# Altium schematic sheet CPU_Logic.SchDoc: Title
size A3; Date: Date; CompanyName: Integrated Micro-Electronics Bulgaria; Organization: Design & Development Department; Address1: Drawing Type; Address2: Address 1; Address3: Address 2; Address4: Address 3; DocumentNumber: 730xxx; Revision: 01; SheetNumber: 1; SheetTotal: 1; PageSetup: Record=PageOptions|CenterHorizontal=True|CenterVertical=True|PrintScale=0.70|XCorrection=1.00|YCorrection=1.00|PrintKind=2|BorderSize=5000000|LeftOffset=0|BottomOffset=0|Orientation=2|PaperLength=1000|PaperWidth=1000|Scale=100|PaperSource=7|PrintQuality=-4|MediaType=1|DitherType=10|PaperKind=A4|PrintScaleMode=1; SheetSize: A3; Time: Time; ModifiedDate: Mod. Date
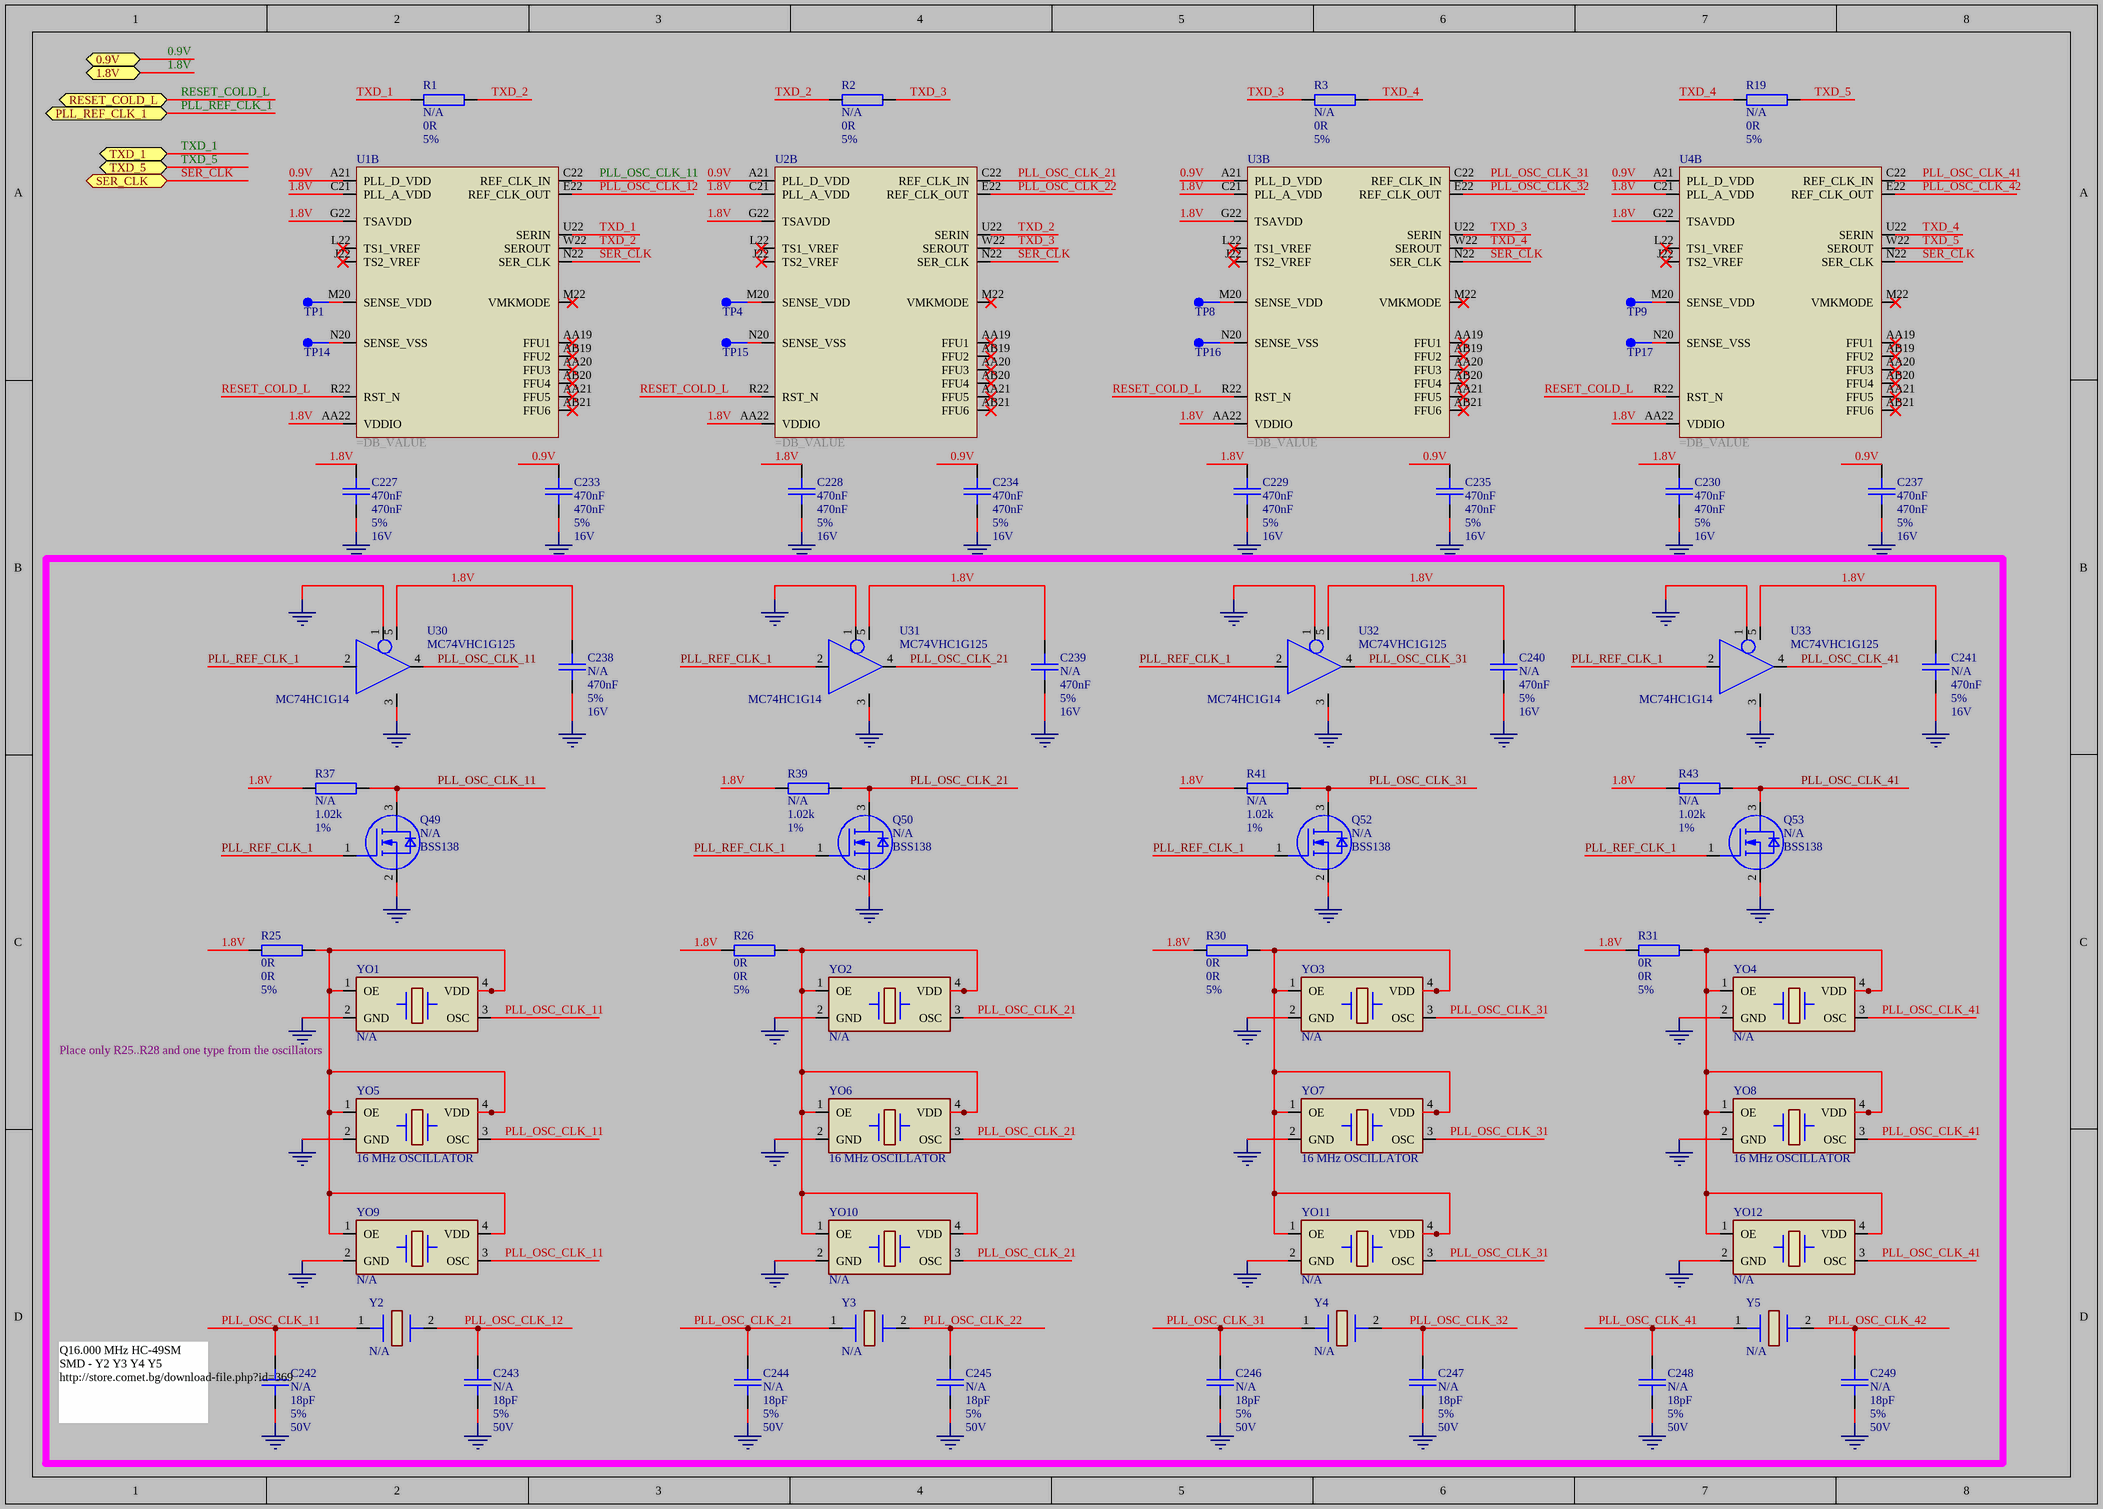
[diagram p0: CPU_Logic.SchDoc]

## Parts
C227  470nF  DB_TOLERANCE: 5%  DB_VOLTAGE: 16V  [SMD_0603_CAPC1608X95N]
C228  470nF  DB_TOLERANCE: 5%  DB_VOLTAGE: 16V  [SMD_0603_CAPC1608X95N]
C229  470nF  DB_TOLERANCE: 5%  DB_VOLTAGE: 16V  [SMD_0603_CAPC1608X95N]
C230  470nF  DB_TOLERANCE: 5%  DB_VOLTAGE: 16V  [SMD_0603_CAPC1608X95N]
C233  470nF  DB_TOLERANCE: 5%  DB_VOLTAGE: 16V  [SMD_0603_CAPC1608X95N]
C234  470nF  DB_TOLERANCE: 5%  DB_VOLTAGE: 16V  [SMD_0603_CAPC1608X95N]
C235  470nF  DB_TOLERANCE: 5%  DB_VOLTAGE: 16V  [SMD_0603_CAPC1608X95N]
C237  470nF  DB_TOLERANCE: 5%  DB_VOLTAGE: 16V  [SMD_0603_CAPC1608X95N]
C238  N/A  DB_VALUE: 470nF  DB_TOLERANCE: 5%  DB_VOLTAGE: 16V  [SMD_0603_CAPC1608X95N]
C239  N/A  DB_VALUE: 470nF  DB_TOLERANCE: 5%  DB_VOLTAGE: 16V  [SMD_0603_CAPC1608X95N]
C240  N/A  DB_VALUE: 470nF  DB_TOLERANCE: 5%  DB_VOLTAGE: 16V  [SMD_0603_CAPC1608X95N]
C241  N/A  DB_VALUE: 470nF  DB_TOLERANCE: 5%  DB_VOLTAGE: 16V  [SMD_0603_CAPC1608X95N]
C242  N/A  DB_VALUE: 18pF  DB_TOLERANCE: 5%  DB_VOLTAGE: 50V  [SMD_0603_CAPC1608X95N]
C243  N/A  DB_VALUE: 18pF  DB_TOLERANCE: 5%  DB_VOLTAGE: 50V  [SMD_0603_CAPC1608X95N]
C244  N/A  DB_VALUE: 18pF  DB_TOLERANCE: 5%  DB_VOLTAGE: 50V  [SMD_0603_CAPC1608X95N]
C245  N/A  DB_VALUE: 18pF  DB_TOLERANCE: 5%  DB_VOLTAGE: 50V  [SMD_0603_CAPC1608X95N]
C246  N/A  DB_VALUE: 18pF  DB_TOLERANCE: 5%  DB_VOLTAGE: 50V  [SMD_0603_CAPC1608X95N]
C247  N/A  DB_VALUE: 18pF  DB_TOLERANCE: 5%  DB_VOLTAGE: 50V  [SMD_0603_CAPC1608X95N]
C248  N/A  DB_VALUE: 18pF  DB_TOLERANCE: 5%  DB_VOLTAGE: 50V  [SMD_0603_CAPC1608X95N]
C249  N/A  DB_VALUE: 18pF  DB_TOLERANCE: 5%  DB_VOLTAGE: 50V  [SMD_0603_CAPC1608X95N]
Q49  N/A  DB_VALUE: BSS138  [SMD_SOT23_SOT95P240X112-3N]
Q50  N/A  DB_VALUE: BSS138  [SMD_SOT23_SOT95P240X112-3N]
Q52  N/A  DB_VALUE: BSS138  [SMD_SOT23_SOT95P240X112-3N]
Q53  N/A  DB_VALUE: BSS138  [SMD_SOT23_SOT95P240X112-3N]
R1  N/A  DB_VALUE: 0R  DB_TOLERANCE: 5%  [SMD_0201_RESC0603X26N]
R2  N/A  DB_VALUE: 0R  DB_TOLERANCE: 5%  [SMD_0201_RESC0603X26N]
R3  N/A  DB_VALUE: 0R  DB_TOLERANCE: 5%  [SMD_0201_RESC0603X26N]
R19  N/A  DB_VALUE: 0R  DB_TOLERANCE: 5%  [SMD_0201_RESC0603X26N]
R25  0R  DB_TOLERANCE: 5%  [SMD_0603_RESC1608X55N]
R26  0R  DB_TOLERANCE: 5%  [SMD_0603_RESC1608X55N]
R30  0R  DB_TOLERANCE: 5%  [SMD_0603_RESC1608X55N]
R31  0R  DB_TOLERANCE: 5%  [SMD_0603_RESC1608X55N]
R37  N/A  DB_VALUE: 1.02k  DB_TOLERANCE: 1%  [SMD_0603_RESC1608X55N]
R39  N/A  DB_VALUE: 1.02k  DB_TOLERANCE: 1%  [SMD_0603_RESC1608X55N]
R41  N/A  DB_VALUE: 1.02k  DB_TOLERANCE: 1%  [SMD_0603_RESC1608X55N]
R43  N/A  DB_VALUE: 1.02k  DB_TOLERANCE: 1%  [SMD_0603_RESC1608X55N]
TP1  100_254  [SMD_TP_100-254]  (value not drawn)
TP4  100_254  [SMD_TP_100-254]  (value not drawn)
TP8  100_254  [SMD_TP_100-254]  (value not drawn)
TP9  100_254  [SMD_TP_100-254]  (value not drawn)
TP14  100_254  [SMD_TP_100-254]  (value not drawn)
TP15  100_254  [SMD_TP_100-254]  (value not drawn)
TP16  100_254  [SMD_TP_100-254]  (value not drawn)
TP17  100_254  [SMD_TP_100-254]  (value not drawn)
U1  (no value)  [SMD_BGA480C80P22X22]  (part B of 2)
U2  (no value)  [SMD_BGA480C80P22X22]  (part B of 2)
U3  (no value)  [SMD_BGA480C80P22X22]  (part B of 2)
U4  (no value)  [SMD_BGA480C80P22X22]  (part B of 2)
U30  DB_VALUE: MC74VHC1G125  [SMD_SOT95P280X110-5N]  (hidden comment: N/A)
U31  DB_VALUE: MC74VHC1G125  [SMD_SOT95P280X110-5N]  (hidden comment: N/A)
U32  DB_VALUE: MC74VHC1G125  [SMD_SOT95P280X110-5N]  (hidden comment: N/A)
U33  DB_VALUE: MC74VHC1G125  [SMD_SOT95P280X110-5N]  (hidden comment: N/A)
Y2  N/A  [SMD_HC49_XTAL1140X480X420N]
Y3  N/A  [SMD_HC49_XTAL1140X480X420N]
Y4  N/A  [SMD_HC49_XTAL1140X480X420N]
Y5  N/A  [SMD_HC49_XTAL1140X480X420N]
YO1  N/A  [SMD_OSCCF320X400X90-4N]
YO2  N/A  [SMD_OSCCF320X400X90-4N]
YO3  N/A  [SMD_OSCCF320X400X90-4N]
YO4  N/A  [SMD_OSCCF320X400X90-4N]
YO5  16 MHz OSCILLATOR  [SMD_OSCCF250X320X90-4N]
YO6  16 MHz OSCILLATOR  [SMD_OSCCF250X320X90-4N]
YO7  16 MHz OSCILLATOR  [SMD_OSCCF250X320X90-4N]
YO8  16 MHz OSCILLATOR  [SMD_OSCCF250X320X90-4N]
YO9  N/A  [SMD_OSCCF200X250X90-4N]
YO10  N/A  [SMD_OSCCF200X250X90-4N]
YO11  N/A  [SMD_OSCCF200X250X90-4N]
YO12  N/A  [SMD_OSCCF200X250X90-4N]

## Ports
0.9V, 1.8V, PLL_REF_CLK_1, RESET_COLD_L, SER_CLK, TXD_1, TXD_5

## Nets
GND: C227.1 C228.1 C229.1 C230.1 C233.1 C234.1 C235.1 C237.1 C238.1 C239.1 C240.1 C241.1 C242.2 C243.2 C244.2 C245.2 C246.2 C247.2 C248.2 C249.2 Q49.2(S) Q50.2(S) Q52.2(S) Q53.2(S) U30.1(~{OE}) U30.3(GND) U31.1(~{OE}) U31.3(GND) U32.1(~{OE}) U32.3(GND) U33.1(~{OE}) U33.3(GND) YO1.2(GND) YO2.2(GND) YO3.2(GND) YO4.2(GND) YO5.2(GND) YO6.2(GND) YO7.2(GND) YO8.2(GND) YO9.2(GND) YO10.2(GND) YO11.2(GND) YO12.2(GND)
0.9V: C233.2 C234.2 C235.2 C237.2 U1.A21(PLL_D_VDD) U2.A21(PLL_D_VDD) U3.A21(PLL_D_VDD) U4.A21(PLL_D_VDD) ; port 0.9V
1.8V: C227.2 C228.2 C229.2 C230.2 C238.2 C239.2 C240.2 C241.2 R25.1 R26.1 R30.1 R31.1 R37.1 R39.1 R41.1 R43.1 U1.AA22(VDDIO) U1.C21(PLL_A_VDD) U1.G22(TSAVDD) U2.AA22(VDDIO) U2.C21(PLL_A_VDD) U2.G22(TSAVDD) U3.AA22(VDDIO) U3.C21(PLL_A_VDD) U3.G22(TSAVDD) U4.AA22(VDDIO) U4.C21(PLL_A_VDD) U4.G22(TSAVDD) U30.5(VCC) U31.5(VCC) U32.5(VCC) U33.5(VCC) ; port 1.8V
PLL_OSC_CLK_11: C242.1 Q49.3(D) R37.2 U1.C22(REF_CLK_IN) U30.4(OUTY) Y2.1 YO1.3(OSC) YO5.3(OSC) YO9.3(OSC)
PLL_OSC_CLK_12: C243.1 U1.E22(REF_CLK_OUT) Y2.2
PLL_OSC_CLK_21: C244.1 Q50.3(D) R39.2 U2.C22(REF_CLK_IN) U31.4(OUTY) Y3.1 YO2.3(OSC) YO6.3(OSC) YO10.3(OSC)
PLL_OSC_CLK_22: C245.1 U2.E22(REF_CLK_OUT) Y3.2
PLL_OSC_CLK_31: C246.1 Q52.3(D) R41.2 U3.C22(REF_CLK_IN) U32.4(OUTY) Y4.1 YO3.3(OSC) YO7.3(OSC) YO11.3(OSC)
PLL_OSC_CLK_32: C247.1 U3.E22(REF_CLK_OUT) Y4.2
PLL_OSC_CLK_41: C248.1 Q53.3(D) R43.2 U4.C22(REF_CLK_IN) U33.4(OUTY) Y5.1 YO4.3(OSC) YO8.3(OSC) YO12.3(OSC)
PLL_OSC_CLK_42: C249.1 U4.E22(REF_CLK_OUT) Y5.2
PLL_REF_CLK_1: Q49.1(G) Q50.1(G) Q52.1(G) Q53.1(G) U30.2(INA) U31.2(INA) U32.2(INA) U33.2(INA) ; port PLL_REF_CLK_1
RESET_COLD_L: U1.R22(RST_N) U2.R22(RST_N) U3.R22(RST_N) U4.R22(RST_N) ; port RESET_COLD_L
SER_CLK: U1.N22(SER_CLK) U2.N22(SER_CLK) U3.N22(SER_CLK) U4.N22(SER_CLK) ; port SER_CLK
TXD_1: R1.1 U1.U22(SERIN) ; port TXD_1
TXD_2: R1.2 R2.1 U1.W22(SEROUT) U2.U22(SERIN)
TXD_3: R2.2 R3.1 U2.W22(SEROUT) U3.U22(SERIN)
TXD_4: R3.2 R19.1 U3.W22(SEROUT) U4.U22(SERIN)
TXD_5: R19.2 U4.W22(SEROUT) ; port TXD_5
NetR25_2: R25.2 YO1.1(OE) YO1.4(VDD) YO5.1(OE) YO5.4(VDD) YO9.1(OE) YO9.4(VDD)
NetR26_2: R26.2 YO2.1(OE) YO2.4(VDD) YO6.1(OE) YO6.4(VDD) YO10.1(OE) YO10.4(VDD)
NetR30_2: R30.2 YO3.1(OE) YO3.4(VDD) YO7.1(OE) YO7.4(VDD) YO11.1(OE) YO11.4(VDD)
NetR31_2: R31.2 YO4.1(OE) YO4.4(VDD) YO8.1(OE) YO8.4(VDD) YO12.1(OE) YO12.4(VDD)
NetTP1_1: TP1.1 U1.M20(SENSE_VDD)
NetTP4_1: TP4.1 U2.M20(SENSE_VDD)
NetTP8_1: TP8.1 U3.M20(SENSE_VDD)
NetTP9_1: TP9.1 U4.M20(SENSE_VDD)
NetTP14_1: TP14.1 U1.N20(SENSE_VSS)
NetTP15_1: TP15.1 U2.N20(SENSE_VSS)
NetTP16_1: TP16.1 U3.N20(SENSE_VSS)
NetTP17_1: TP17.1 U4.N20(SENSE_VSS)

Not connected (* = marked no-connect by the designer): U1 AA19(FFU1)* AA20(FFU3)* AA21(FFU5)* AB19(FFU2)* AB20(FFU4)* AB21(FFU6)* J22(TS2_VREF)* L22(TS1_VREF)* M22(VMKMODE)*; U2 AA19(FFU1)* AA20(FFU3)* AA21(FFU5)* AB19(FFU2)* AB20(FFU4)* AB21(FFU6)* J22(TS2_VREF)* L22(TS1_VREF)* M22(VMKMODE)*; U3 AA19(FFU1)* AA20(FFU3)* AA21(FFU5)* AB19(FFU2)* AB20(FFU4)* AB21(FFU6)* J22(TS2_VREF)* L22(TS1_VREF)* M22(VMKMODE)*; U4 AA19(FFU1)* AA20(FFU3)* AA21(FFU5)* AB19(FFU2)* AB20(FFU4)* AB21(FFU6)* J22(TS2_VREF)* L22(TS1_VREF)* M22(VMKMODE)*

## Notes on the sheet
- (near U30) MC74HC1G14
- (near U31) MC74HC1G14
- (near U32) MC74HC1G14
- (near U33) MC74HC1G14
- (near YO1) Place only R25..R28 and one type from the oscillators
- Q16.000 MHz HC-49SM SMD - Y2 Y3 Y4 Y5
  http://store.comet.bg/download-file.php?id=369

## Library data of the parts
C227-C230 C233-C235 C237-C241 = CAP000028169: DB_PART_TYPE: Ceramic_SMD\Standard_X7R; DB_MANUFACTURER_PART: KEMET    C0603C474J4RAC; NOTE: <NOTE>; DB_T_RANGE: -55 to 125; DB_PACKAGE: 0603; DB_DESCRIPTION: C X7R 470nF 5% 16V 0603; DB_STATUS: NEW; DB_PART_NUMBER: CAP000028169; DB_PCB_DEVICE: SMD_0603_CAPC1608X95N; DB_APPROVED_ON: 09.10.2010; DB_DATASHEET: http://john.epiqdesign.com/projects/CIS_Datasheets/F3102_CE_Kemet.pdf?rev=92&sc=0
  C227-C230 C233-C235 C237: DB_VALUE: 470nF
C242-C249 = CAP000031922: DB_PART_TYPE: Ceramic_SMD\Standard_C0G; DB_MANUFACTURER_PART: KEMET    C0603C180J5GAC; NOTE: <NOTE>; DB_T_RANGE: -55 to 125; DB_PACKAGE: 0603; DB_DESCRIPTION: C C0G 18pF 5% 50V 0603; DB_STATUS: NEW; DB_PART_NUMBER: CAP000031922; DB_PCB_DEVICE: SMD_0603_CAPC1608X95N; DB_APPROVED_ON: 09.10.2010; DB_DATASHEET: http://john.epiqdesign.com/projects/CIS_Datasheets/F3102_CE_Kemet.pdf?rev=92&sc=0
Q49 Q50 Q52 Q53 = TRA000001460: DB_PART_TYPE: MOSFET\N_Channel; DB_MANUFACTURER_PART: FAIRCHILD        BSS138LT1G; NOTE: <NOTE>; DB_T_RANGE: -55 to 150; DB_VOLTAGE: 50V; DB_CURRENT: 0.22A; DB_PACKAGE: SOT-23-3; DB_DESCRIPTION: TRANS BSS138 SOT-23-3; DB_APPROVED_BY: VSN; DB_STATUS: NEW; DB_PART_NUMBER: TRA000001460; DB_PCB_DEVICE: SMD_SOT23_SOT95P240X112-3N; DB_APPROVED_ON: 14.01.2011 10:29:14; DB_DATASHEET: http://john.epiqdesign.com/projects/CIS_Datasheets/BSS138LT1-D_Fairchild.pdf?rev=55&sc=0
R1-R3 R19 = RES000005659: DB_PART_TYPE: SMD; DB_MANUFACTURER_PART: YAGEO    RC0201JR-070R; NOTE: <NOTE>; R_BDS: R; DB_T_RANGE: -55 to 125; DB_POWER: 1/20W; DB_PACKAGE: 0201; DB_DESCRIPTION: R SMD 0R 5% 1/20W 0201; DB_PRICE: 0.00269; DB_STATUS: NEW; DB_PART_NUMBER: RES000005659; DB_PCB_DEVICE: SMD_0201_RESC0603X26N; DB_PRICE_DATE: 07-02-2013; DB_APPROVED_ON: 09.10.2010; DB_DATASHEET: http://john.epiqdesign.com/projects/CIS_Datasheets/PYu-RC0201_51_RoHS_L_7_YAGEO.pdf?rev=138&sc=0
R25 R26 R30 R31 = RES000006349: DB_PART_TYPE: SMD; DB_MANUFACTURER_PART: YAGEO    RC0603JR-070R; NOTE: <NOTE>; R_BDS: R; DB_T_RANGE: -55 to 155; DB_POWER: 1/10W; DB_PACKAGE: 0603; DB_DESCRIPTION: R SMD 0R 5% 1/10W 0603; DB_PRICE: 0.000364; DB_MOQ: 5000; DB_STATUS: NEW; DB_PART_NUMBER: RES000006349; DB_VALUE: 0R; DB_PCB_DEVICE: SMD_0603_RESC1608X55N; DB_PRICE_DATE: 2010-12-23; DB_APPROVED_ON: 09.10.2010; DB_DATASHEET: http://john.epiqdesign.com/projects/CIS_Datasheets/PYu-RC0603_51_RoHS_L_4_YAGEO.pdf?rev=138&sc=0
R37 R39 R41 R43 = RES000001446: DB_PART_TYPE: SMD; DB_MANUFACTURER_PART: YAGEO    RC0603FR-071K02; NOTE: <NOTE>; R_BDS: R; DB_T_RANGE: -55 to 155; DB_POWER: 1/10W; DB_PACKAGE: 0603; DB_DESCRIPTION: R SMD 1K02 1% 1/10W 0603; DB_PRICE: 0.00063; DB_MOQ: 5000; DB_STATUS: NEW; DB_PART_NUMBER: RES000001446; DB_PCB_DEVICE: SMD_0603_RESC1608X55N; DB_PRICE_DATE: 2010-12-23; DB_APPROVED_ON: 09.10.2010; DB_DATASHEET: http://john.epiqdesign.com/projects/CIS_Datasheets/PYu-RC0603_51_RoHS_L_4_YAGEO.pdf?rev=138&sc=0
TP1 TP4 TP8 TP9 TP14-TP17 = TPO000000001: DB_PART_TYPE: Test Point; DB_DESCRIPTION: Test Point 100_254; DB_STATUS: NEW; DB_PART_NUMBER: TPO000000001; DB_VALUE: 100_254; DB_DIAMETER: 100_254; DB_PCB_DEVICE: SMD_TP_100-254; DB_APPROVED_ON: 10.09.2010
U1-U4 = IC_RockerBox: DB_PCB_DEVICE: SMD_BGA480C80P22X22
U30-U33 = DIG000000005: DB_PART_TYPE: Buffer; DB_MANUFACTURER_PART: ON Semiconductor       M74VHC1G125DTT1G; NOTE: <NOTE>; DB_T_RANGE: -55 to 125; DB_PACKAGE: SOT23-5; DB_DESCRIPTION: IC MC74VHC1G125 SOT23-5; DB_APPROVED_BY: VSN; DB_STATUS: NEW; DB_PART_NUMBER: DIG000000005; DB_PCB_DEVICE: SMD_SOT95P280X110-5N; DB_APPROVED_ON: 13.10.2011 11:24:30; DB_DATASHEET: http://john.epiqdesign.com/projects/CIS_Datasheets/MC74VHC1G125-DNoninverting_3-State_Buffer_ON_Semi.pdf?rev=477&sc=0
Y2-Y5 = XTAL: NOTE: <NOTE>; DB_PCB_DEVICE: SMD_HC49_XTAL1140X480X420N
YO1-YO12 = XTAL_OE1GND2OSC3VDD4: NOTE: <NOTE>
  YO1-YO4: DB_PCB_DEVICE: SMD_OSCCF320X400X90-4N
  YO5-YO8: DB_PCB_DEVICE: SMD_OSCCF250X320X90-4N
  YO9-YO12: DB_PCB_DEVICE: SMD_OSCCF200X250X90-4N